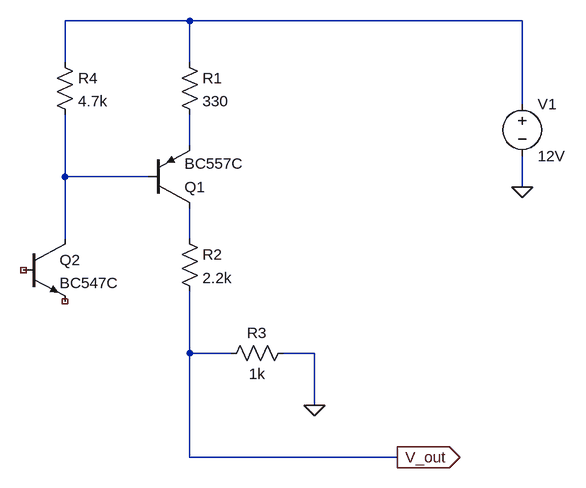
[diagram p0: schematic input_stage.asc]
input_stage.asc, the LTspice schematic file:
Version 4
SHEET 1 880 680
WIRE 160 -80 -32 -80
WIRE 672 -80 160 -80
WIRE -32 -16 -32 -80
WIRE 160 -16 160 -80
WIRE 672 48 672 -80
WIRE 160 112 160 64
WIRE -32 160 -32 64
WIRE 96 160 -32 160
WIRE 672 176 672 128
WIRE -32 256 -32 160
WIRE 160 256 160 208
WIRE 160 432 160 336
WIRE 224 432 160 432
WIRE 352 432 304 432
WIRE 352 512 352 432
WIRE 160 592 160 432
WIRE 480 592 160 592
FLAG 352 512 0
FLAG 672 176 0
FLAG 480 592 V_out
IOPIN 480 592 Out
SYMBOL pnp2 96 208 M180
SYMATTR InstName Q1
SYMATTR Value BC557C
SYMBOL res 144 -32 R0
SYMATTR InstName R1
SYMATTR Value 330
SYMBOL voltage 672 32 R0
WINDOW 123 0 0 Left 0
WINDOW 39 0 0 Left 0
SYMATTR InstName V1
SYMATTR Value 12V
SYMBOL res 144 240 R0
SYMATTR InstName R2
SYMATTR Value 2.2k
SYMBOL res 320 416 R90
WINDOW 0 0 56 VBottom 2
WINDOW 3 32 56 VTop 2
SYMATTR InstName R3
SYMATTR Value 1k
SYMBOL npn2 -96 256 R0
SYMATTR InstName Q2
SYMATTR Value BC547C
SYMBOL res -48 -32 R0
SYMATTR InstName R4
SYMATTR Value 4.7k

The netlist it stands for:
* input_stage.asc
Q1 N004 N003 N002 0 BC557C
R1 N001 N002 330
V1 N001 0 12V
R2 N004 V_out 2.2k
R3 0 V_out 1k
Q2 N003 NC_01 NC_02 0 BC547C
R4 N001 N003 4.7k
.model NPN NPN
.model PNP PNP
.lib standard.bjt
.backanno
.end